# Altium schematic sheet 2.PFC.SchDoc: 6.6kW Daul OBC +11kW WPT
size A3; Date: 19/12/16; Revision: V 1.0; SheetNumber: 2; SheetTotal: 14; PageSetup: Record=PageOptions|CenterHorizontal=True|CenterVertical=True|PrintScale=0.71|XCorrection=1.00|YCorrection=1.00|PrintKind=2|BorderSize=5000000|LeftOffset=0|BottomOffset=0|Orientation=2|PaperLength=1000|PaperWidth=1000|Scale=100|PaperSource=7|PrintQuality=-4|MediaType=1|DitherType=10|PrintScaleMode=1|PaperKind=A4; ImagePath: 0
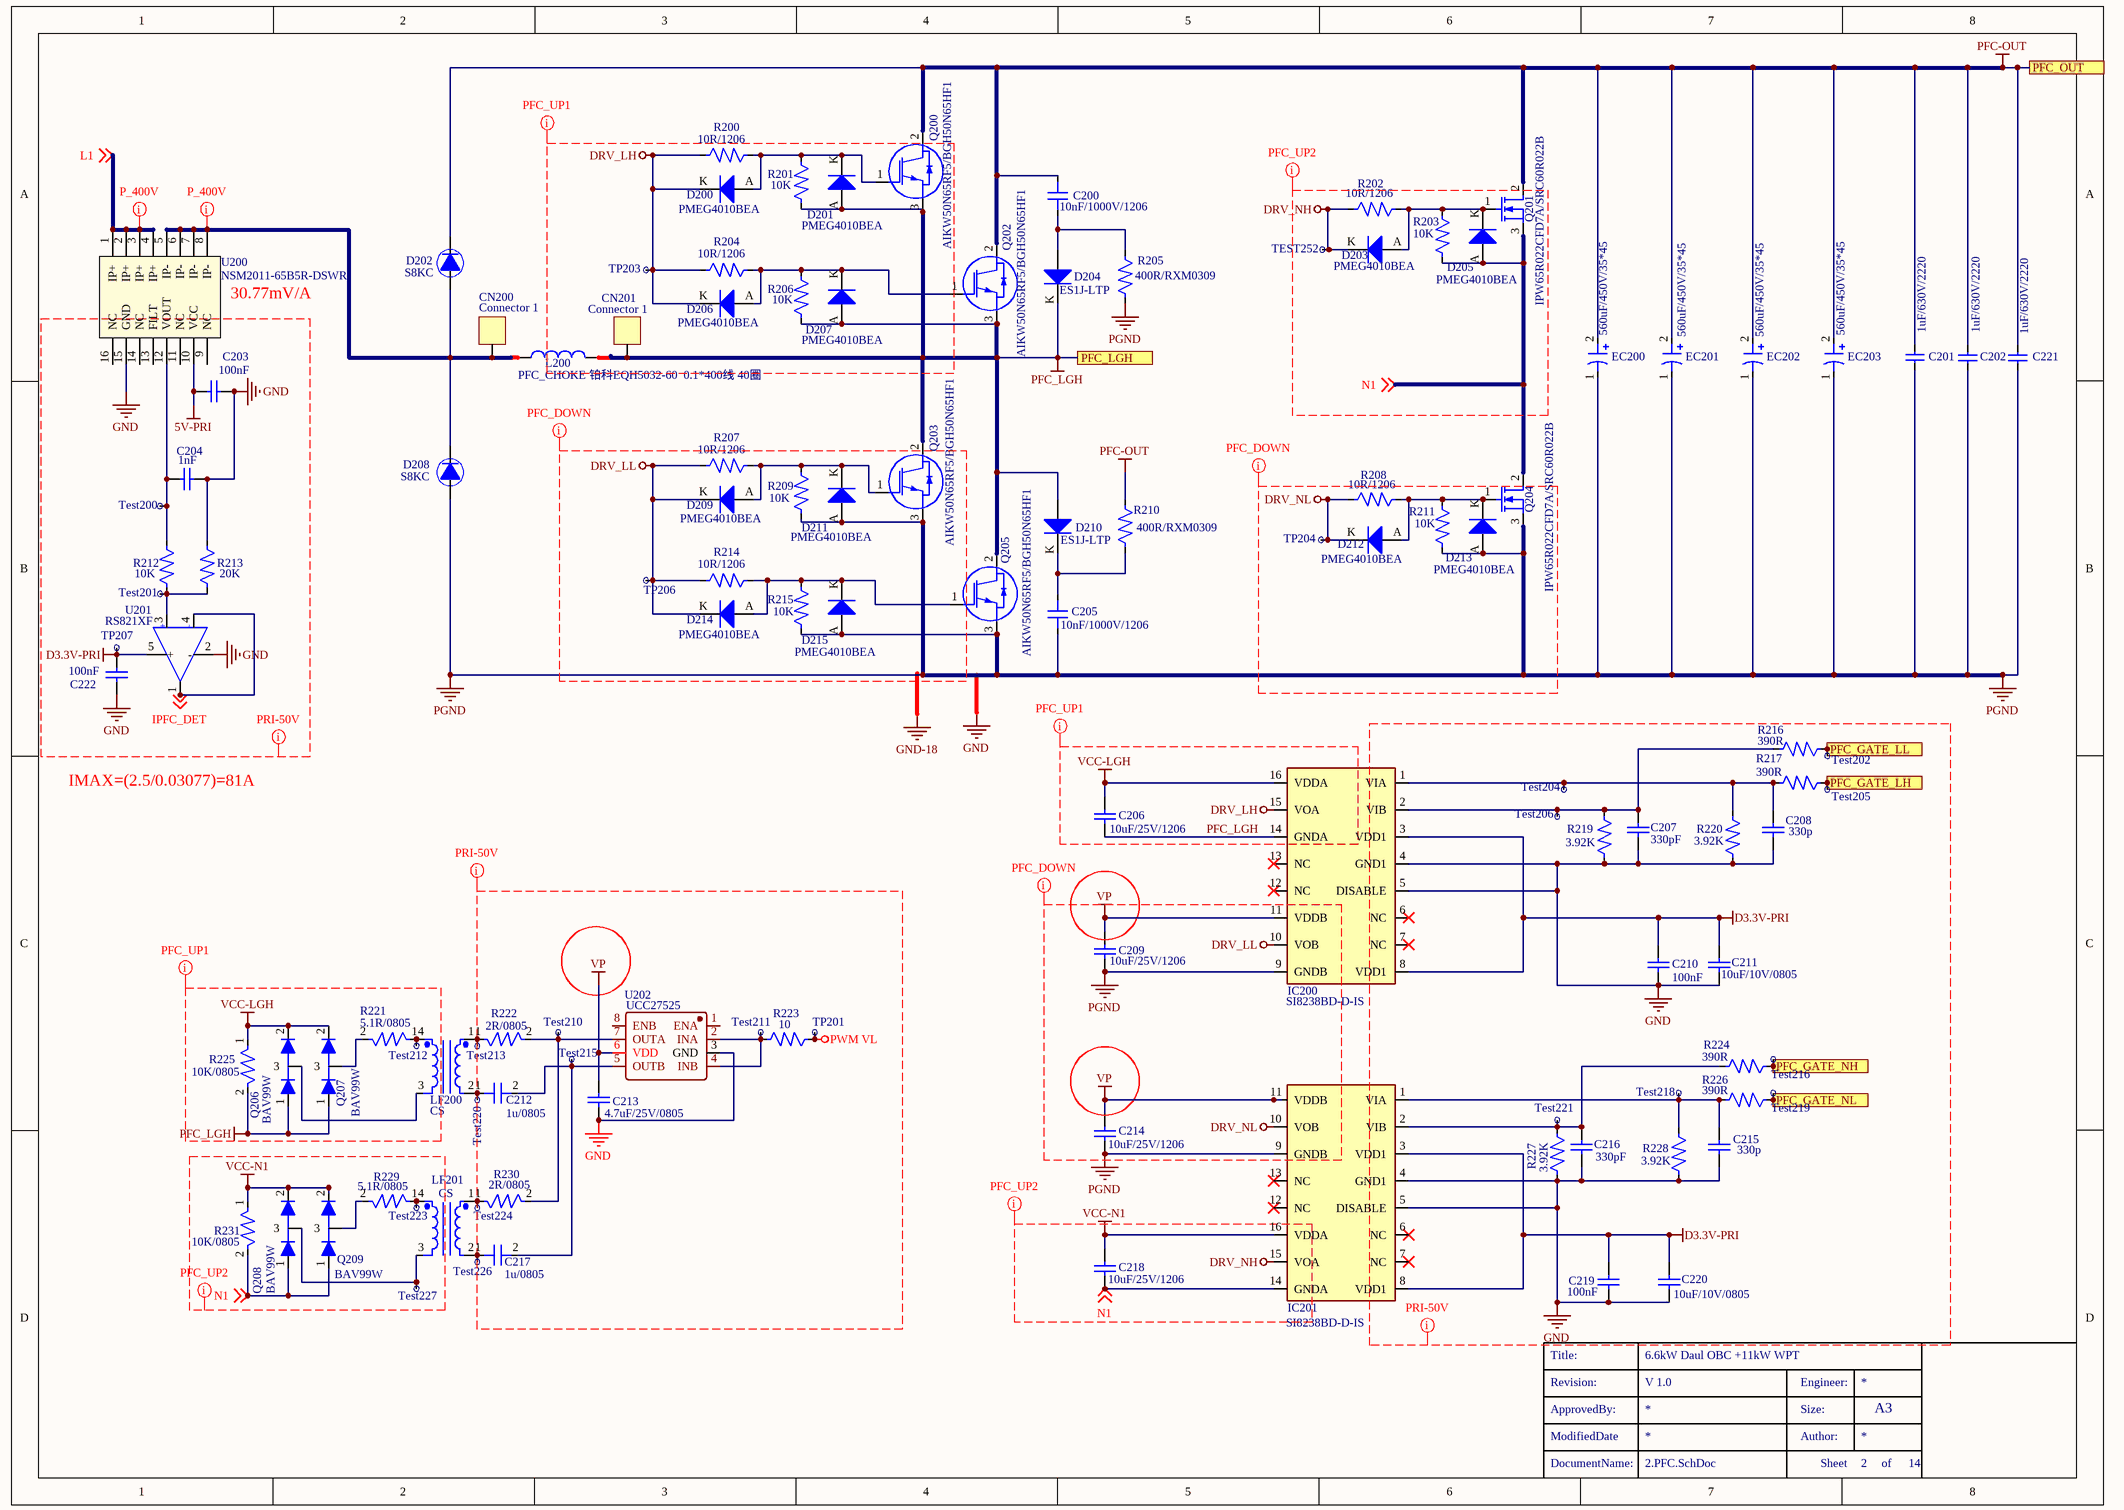
[diagram p0: 2.PFC.SchDoc]

## Parts
C200  10nF/1000V/1206  [C1206]
C201  1uF/630V/2220  [C2220]
C202  1uF/630V/2220  [C2220]
C203  100nF  [C0402]
C204  1nF  [C0402]
C205  10nF/1000V/1206  [C1206]
C206  10uF/25V/1206  [C1206]
C207  330pF  [C0402]
C208  330p  [C0402]
C209  10uF/25V/1206  [C1206]
C210  100nF  [C0402]
C211  10uF/10V/0805  [C0805]
C212  1u/0805  [C0805]
C213  4.7uF/25V/0805  [C0805]
C214  10uF/25V/1206  [C1206]
C215  330p  [C0402]
C216  330pF  [C0402]
C217  1u/0805  [C0805]
C218  10uF/25V/1206  [C1206]
C219  100nF  [C0402]
C220  10uF/10V/0805  [C0805]
C221  1uF/630V/2220  [C2220]
C222  100nF  [C0402]
CN200  Connector 1  [CON_4-7*5]
CN201  Connector 1  [CON_4]
D200  PMEG4010BEA  [D_SOD323]
D201  PMEG4010BEA  [D_SOD323]
D202  S8KC  [D_SMC]
D203  PMEG4010BEA  [D_SOD323]
D204  ES1J-LTP  [DO-214AC]
D205  PMEG4010BEA  [D_SOD323]
D206  PMEG4010BEA  [D_SOD323]
D207  PMEG4010BEA  [D_SOD323]
D208  S8KC  [D_SMC]
D209  PMEG4010BEA  [D_SOD323]
D210  ES1J-LTP  [DO-214AC]
D211  PMEG4010BEA  [D_SOD323]
D212  PMEG4010BEA  [D_SOD323]
D213  PMEG4010BEA  [D_SOD323]
D214  PMEG4010BEA  [D_SOD323]
D215  PMEG4010BEA  [D_SOD323]
EC200  560uF/450V/35*45  [Ecap_D35(e1)_H25]
EC201  560uF/450V/35*45  [Ecap_D35(e1)_H25]
EC202  560uF/450V/35*45  [Ecap_D35(e1)_H25]
EC203  560uF/450V/35*45  [Ecap_D35(e1)_H25]
IC200  SI8238BD‐D‐IS  [SOIC_W_16]
IC201  SI8238BD‐D‐IS  [SOIC_W_16]
L200  PFC_CHOKE 铂科EQH5032-60  0.1*400线 40圈  [EQ5032-60 立式]
LF200  CS  [GATE DRIVER EE5_0]
LF201  CS  [GATE DRIVER EE5_0]
Q200  AIKW50N65RF5/BGH50N65HF1  [Q_TO-247_TH _1]
Q201  IPW65R022CFD7A/SRC60R022B  [Q_TO-247_TH _1]
Q202  AIKW50N65RF5/BGH50N65HF1  [Q_TO-247_TH _1]
Q203  AIKW50N65RF5/BGH50N65HF1  [Q_TO-247_TH _1]
Q204  IPW65R022CFD7A/SRC60R022B  [Q_TO-247_TH _1]
Q205  AIKW50N65RF5/BGH50N65HF1  [Q_TO-247_TH _1]
Q206  BAV99W  [SOT323 - 2]
Q207  BAV99W  [SOT323 - 2]
Q208  BAV99W  [SOT323 - 2]
Q209  BAV99W  [SOT323 - 2]
R200  10R/1206  [R1206]
R201  10K  [R0402]
R202  10R/1206  [R1206]
R203  10K  [R0402]
R204  10R/1206  [R1206]
R205  400R/RXM0309  [RXM0309]
R206  10K  [R0402]
R207  10R/1206  [R1206]
R208  10R/1206  [R1206]
R209  10K  [R0402]
R210  400R/RXM0309  [RXM0309]
R211  10K  [R0402]
R212  10K  [R0402]
R213  20K  [R0402]
R214  10R/1206  [R1206]
R215  10K  [R0402]
R216  390R  [R0402]
R217  390R  [R0402]
R219  3.92K  [R0402]
R220  3.92K  [R0402]
R221  5.1R/0805  [R0805]
R222  2R/0805  [R0805]
R223  10  [R0402]
R224  390R  [R0402]
R225  10K/0805  [R0805]
R226  390R  [R0402]
R227  3.92K  [R0402]
R228  3.92K  [R0402]
R229  5.1R/0805  [R0805]
R230  2R/0805  [R0805]
R231  10K/0805  [R0805]
Test200  测试点  [测试点]  (value not drawn)
Test201  测试点  [测试点]  (value not drawn)
Test202  测试点  [测试点]  (value not drawn)
Test204  测试点  [测试点]  (value not drawn)
Test205  测试点  [测试点]  (value not drawn)
Test206  测试点  [测试点]  (value not drawn)
Test210  测试点  [测试点]  (value not drawn)
Test211  测试点  [测试点]  (value not drawn)
Test212  测试点  [测试点]  (value not drawn)
Test213  测试点  [测试点]  (value not drawn)
Test215  测试点  [测试点]  (value not drawn)
Test216  测试点  [测试点]  (value not drawn)
Test218  测试点  [测试点]  (value not drawn)
Test219  测试点  [测试点]  (value not drawn)
Test220  测试点  [测试点]  (value not drawn)
Test221  测试点  [测试点]  (value not drawn)
Test223  测试点  [测试点]  (value not drawn)
Test224  测试点  [测试点]  (value not drawn)
Test226  测试点  [测试点]  (value not drawn)
Test227  测试点  [测试点]  (value not drawn)
TEST252  测试点  [测试点]  (value not drawn)
TP201  测试点  [测试点]  (value not drawn)
TP203  测试点  [测试点]  (value not drawn)
TP204  测试点  [测试点]  (value not drawn)
TP206  测试点  [测试点]  (value not drawn)
TP207  测试点  [测试点]  (value not drawn)
U200  NSM2011-65B5R-DSWR  [SOIC_W_16]
U201  RS821XF  [SOT23-5]
U202  UCC27525  [SOIC_8]

## Ports
PFC_GATE_LH, PFC_GATE_LL, PFC_GATE_NH, PFC_GATE_NL, PFC_LGH, PFC_OUT

## Nets
5V-PRI: C203.2 U200.10(VCC)
D3.3V-PRI: C210.2 C211.1 C219.2 C220.1 C222.1 IC200.3(VDD1) IC200.8(VDD1) IC201.3(VDD1) IC201.8(VDD1) TP207.1 U201.5(+)
DRV_LH: D200.K D206.K IC200.15(VOA) R200.2 R204.2 TP203.1
DRV_LL: D209.K D214.K IC200.10(VOB) R207.2 R214.2 TP206.1
DRV_NH: D203.K IC201.15(VOA) R202.2 TEST252.1
DRV_NL: D212.K IC201.10(VOB) R208.2 TP204.1
GND: C203.1 C204.2 C207.1 C208.1 C210.1 C211.2 C213.1 C215.1 C216.1 C219.1 C220.2 C222.2 IC200.4(GND1) IC200.5(DISABLE) IC201.4(GND1) IC201.5(DISABLE) R213.2 R219.2 R220.2 R227.2 R228.2 U200.15(GND) U201.2(-) U202.3(GND)
PFC-OUT: C200.1 C201.2 C202.2 C221.2 D202.K EC200.2 EC201.2 EC202.2 EC203.2 Q200.2 Q201.2(D) Q202.2 R210.2 ; port PFC_OUT
PFC_LGH: C206.1 CN201.1 D201.A D204.K D207.A D210.A IC200.14(GNDA) Q200.3 Q202.3 Q203.2 Q205.2 Q206.1(A) Q207.1(A) R201.2 R206.2 R225.2 ; port PFC_LGH
PGND: C201.1 C202.1 C205.2 C209.1 C214.1 C221.1 D208.A D211.A D213.A D215.A EC200.1 EC201.1 EC202.1 EC203.1 IC200.9(GNDB) IC201.9(GNDB) Q203.3 Q204.3(S) Q205.3 R205.2 R209.2 R211.2 R215.2
PWM VL: R223.1 TP201.1
VCC-LGH: C206.2 IC200.16(VDDA) Q206.2(K) Q207.2(K) R225.1
VCC-N1: C218.2 IC201.16(VDDA) Q208.2(K) Q209.2(K) R231.1
VP: C209.2 C213.2 C214.2 IC200.11(VDDB) IC201.11(VDDB) U202.6(VDD)
IPFC_DET: U201.1(OUTPUT) U201.4(-VIN) ; off-sheet IPFC_DET
L1: U200.1(IP+) U200.2(IP+) U200.3(IP+) U200.4(IP+) ; off-sheet L1
N1: C218.1 D205.A IC201.14(GNDA) Q201.3(S) Q204.2(D) Q208.1(A) Q209.1(A) R203.2 R231.2 ; off-sheet N1
PFC_GATE_LH: R217.1 Test205.1 ; port PFC_GATE_LH
PFC_GATE_LL: R216.1 Test202.1 ; port PFC_GATE_LL
PFC_GATE_NH: R224.1 Test216.1 ; port PFC_GATE_NH
PFC_GATE_NL: R226.1 Test219.1 ; port PFC_GATE_NL
NetC200_2: C200.2 D204.A R205.1
NetC204_1: C204.1 R212.2 Test200.1 U200.12(VOUT)
NetC205_1: C205.1 D210.K R210.1
NetC207_2: C207.2 IC200.2(VIB) R216.2 R219.1 Test206.1
NetC208_2: C208.2 IC200.1(VIA) R217.2 R220.1 Test204.1
NetC212_1: C212.1 LF200.2 Test220.1
NetC212_2: C212.2 C217.2 Test215.1 U202.5(OUTB)
NetC215_2: C215.2 IC201.1(VIA) R226.2 R228.1 Test218.1
NetC216_2: C216.2 IC201.2(VIB) R224.2 R227.1 Test221.1
NetC217_1: C217.1 LF201.2 Test226.1
NetCN200_1: CN200.1 D202.A D208.K U200.5(IP-) U200.6(IP-) U200.7(IP-) U200.8(IP-)
NetD200_A: D200.A D201.K Q200.1 R200.1 R201.1
NetD203_A: D203.A D205.K Q201.1(G) R202.1 R203.1
NetD206_A: D206.A D207.K Q202.1 R204.1 R206.1
NetD209_A: D209.A D211.K Q203.1 R207.1 R209.1
NetD212_A: D212.A D213.K Q204.1(G) R208.1 R211.1
NetD214_A: D214.A D215.K Q205.1 R214.1 R215.1
NetLF200_1: LF200.1 R222.1 Test213.1
NetLF200_3: LF200.3 Q206.3
NetLF200_4: LF200.4 R221.1 Test212.1
NetLF201_1: LF201.1 R230.1 Test224.1
NetLF201_3: LF201.3 Q208.3 Test227.1
NetLF201_4: LF201.4 R229.1 Test223.1
NetQ207_3: Q207.3 R221.2
NetQ209_3: Q209.3 R229.2
NetR212_1: R212.1 R213.1 Test201.1 U201.3(+VIN)
NetR222_2: R222.2 R230.2 Test210.1 U202.7(OUTA)
NetR223_2: R223.2 Test211.1 U202.2(INA) U202.4(INB)

Not connected (* = marked no-connect by the designer): IC200 6(NC)* 7(NC)* 12(NC)* 13(NC)*; IC201 6(NC)* 7(NC)* 12(NC)* 13(NC)*; L200 1 2; U200 9(NC) 11(NC) 13(FILT) 14(NC) 16(NC); U202 1(ENA) 8(ENB)

## Layout directives
net class PFC_UP1: DRV_LH, PFC_LGH, VCC-LGH
net class PFC_UP2: DRV_NH, N1, VCC-N1
net class PFC_DOWN: DRV_LL, DRV_NL, PGND, VP
net class P_400V: L1, NetCN200_1
net class PRI-50V: 5V-PRI, D3.3V-PRI, GND, IPFC_DET, PWM VL, VP

## Notes on the sheet
- (near U200) 30.77mV/A
- IMAX=(2.5/0.03077)=81A
- Labels drawn without touching a wire or pin: GND, GND-18
- Revision:
- Title:
- Engineer:
- ModifiedDate
- ApprovedBy:
- Author:
- Size:
- A3
- DocumentName:
- Sheet
- of

## Library data of the parts
C200 C205 = CAPACITOR_1206: MLCC Capacitor; DIP/SMD: SMD; Top/Bottom: Top; Revision: 1
C201 C202 C221 = 100033967: CBB21_105/630V; DIP/SMD: DIP; Top/Bottom: Top
C203 C204 = CAP: DIP/SMD: SMD; Top/Bottom: Bottom
C206 C209 C214 C218 = Cap: Capacitor; Published: 8-Jun-2000; LatestRevisionDate: 17-Jul-2002; LatestRevisionNote: Re-released for DXP Platform.; PackageReference: RAD-0.3; Publisher: Altium Limited; PackageDescription: Radial Cap, Thru-Hole; 2 Leads; 0.3 in Pin Spacing
C207 C208 C210 C211 C215 C216 C219 C220 C222 = CAP
C212 C217 = CAPACITOR_ YCAP: CC0603KRX7R7BB105; Revision: 1
C213 = Cap: Capacitor; DIP/SMD: SMD; Top/Bottom: Top; Published: 8-Jun-2000; LatestRevisionDate: 17-Jul-2002; LatestRevisionNote: Re-released for DXP Platform.; PackageReference: RAD-0.3; Publisher: Altium Limited; PackageDescription: Radial Cap, Thru-Hole; 2 Leads; 0.3 in Pin Spacing
CN200 CN201 = Connector 1: Header, 1-Pin; Revision: 17-Jul-2002: Re-released for DXP Platform.; Publisher: Altium Limited
D200 D201 D203 D205-D207 D209 D211-D215 = DIODE_BAT54J: 30V 200mA SOD523 NXP; DIP/SMD: SMD; Top/Bottom: Top
D202 D208 = DIODE_HIGH CURRENT_SMD: 800V 8A SMC LITEON; DIP/SMD: SMD; Top/Bottom: Top
D204 D210 = DIODE_MICRO: 600V 1A DO-214AC MCC; DIP/SMD: SMD; Top/Bottom: Top
EC200-EC203 = CAP_Ecap: 560uF/450V 20% 35*45; DIP/SMD: DIP; Top/Bottom: Top
IC200 IC201 = ADuM4223/ADuM3223
L200 = Inductor: Code_IEC: 1005; Published: 8-Jun-2000; LatestRevisionDate: 29-May-2009; LatestRevisionNote: IPC-7351 Footprint Added.; PackageReference: 0402-A; Publisher: Altium Limited; PackageDescription: Chip Inductor; Code_JEITA: 0402
LF200 LF201 = CS: current transformer
Q200 Q202 Q203 Q205 = TO-247-3
Q201 Q204 = MOSFET_N CHANNEL: N MOS FET; Parameter: 2N7002K-T1GE3
Q206-Q209 = BAV99
R200 R202 R204 R207 R208 R214 = RESISTOR_0805: RESISTOR; DIP/SMD: SMD; Top/Bottom: Top
R201 R203 R206 R209 R211 R215 = RESISTOR_0805: 4.99K 1% 厚膜 1/16W 0402 YAGEO; DIP/SMD: SMD; Top/Bottom: Top
R205 R210 = RESISTOR_1210: RESISTOR; DIP/SMD: SMD; Top/Bottom: Top
R212 R213 R216 R217 R219 R220 R223 R224 R226-R228 = RESISTOR
R221 R222 R225 R229-R231 = RESISTOR_1206: 1206W4F0000T5E
U200 = U-NSM2011-100B5R
U201 = OPA365
U202 = SL27524: BOM_Manufacturer: Slkor(萨科微); Contributor: LCSC; BOM_Supplier: LCSC; BOM_Supplier Part: C2690325; BOM_Manufacturer Part: SL27524; BOM_JLCPCB Part Class: Extended Part; spicePre: U; spiceSymbolName: SL27524